# Altium schematic sheet Phaser_2.SchDoc
size A; DocumentNumber: 4; SheetNumber: 4; SheetTotal: 5
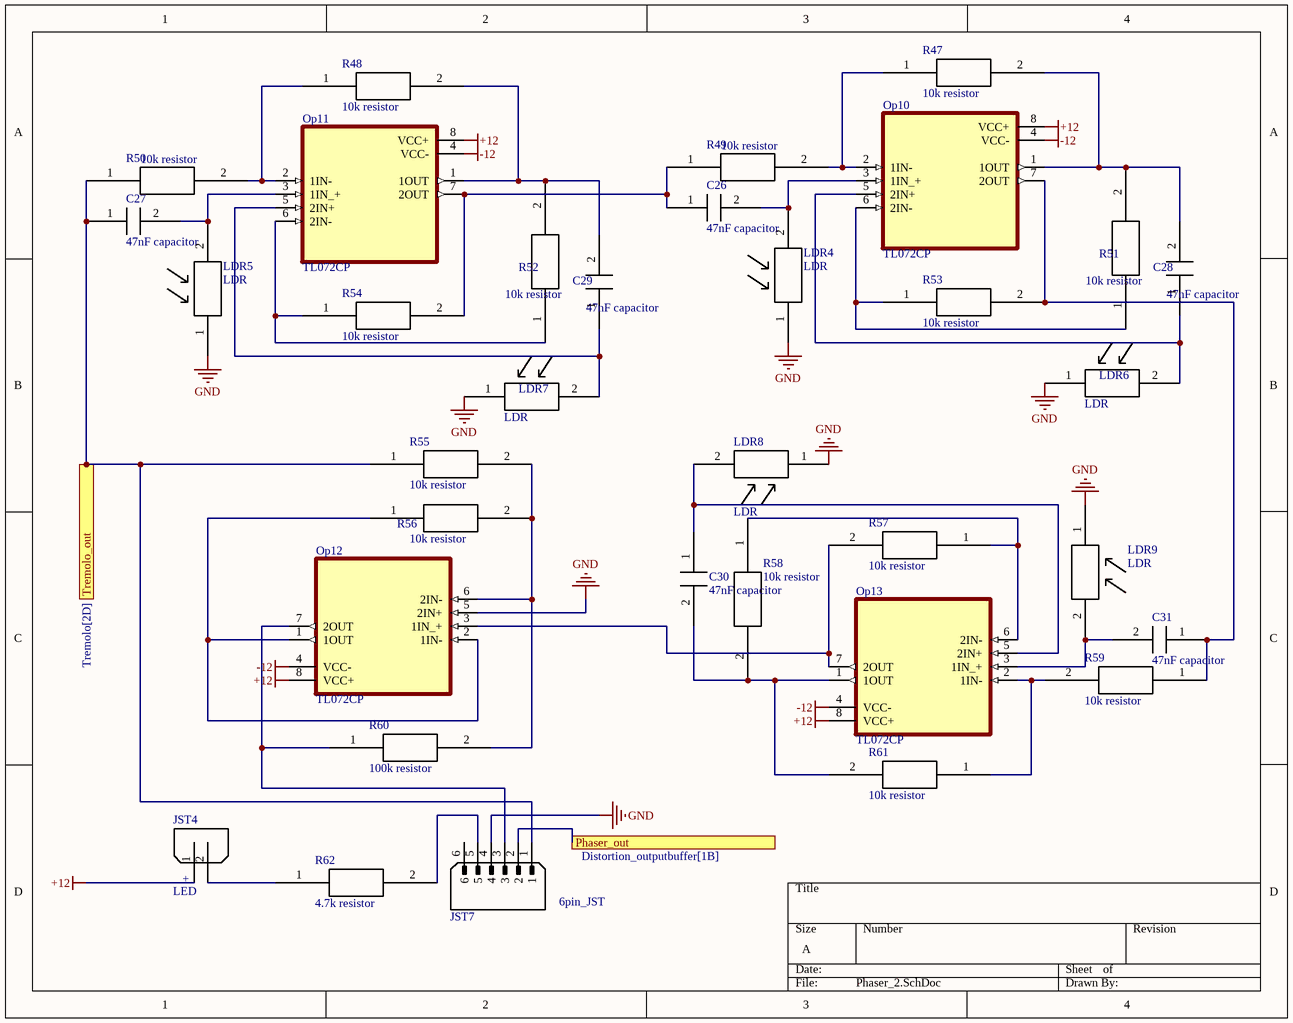
[diagram p0: Phaser_2.SchDoc]

## Parts
C26  47nF capacitor  [47nF]
C27  47nF capacitor  [47nF]
C28  47nF capacitor  [47nF]
C29  47nF capacitor  [47nF]
C30  47nF capacitor  [47nF]
C31  47nF capacitor  [47nF]
JST4  LED  [2pin_JST]
JST7  6pin_JST  [6pin_JST]
LDR4  LDR  [LDR]
LDR5  LDR  [LDR]
LDR6  LDR  [LDR]
LDR7  LDR  [LDR]
LDR8  LDR  [LDR]
LDR9  LDR  [LDR]
Op10  TL072CP  [TL072CP]
Op11  TL072CP  [TL072CP]
Op12  TL072CP  [TL072CP]
Op13  TL072CP  [TL072CP]
R47  10k resistor  [10k]
R48  10k resistor  [10k]
R49  10k resistor  [10k]
R50  10k resistor  [10k]
R51  10k resistor  [10k]
R52  10k resistor  [10k]
R53  10k resistor  [10k]
R54  10k resistor  [10k]
R55  10k resistor  [10k]
R56  10k resistor  [10k]
R57  10k resistor  [10k]
R58  10k resistor  [10k]
R59  10k resistor  [10k]
R60  100k resistor  [100k]
R61  10k resistor  [10k]
R62  4.7k resistor  [4.7k]

## Ports
Phaser_out (see Distortion_outputbuffer[1B]), Tremolo_out (see Tremolo[2D])

## Nets
+12: JST4.1 Op10.8(VCC+) Op11.8(VCC+) Op12.8(VCC+) Op13.8(VCC+)
-12: Op10.4(VCC-) Op11.4(VCC-) Op12.4(VCC-) Op13.4(VCC-)
GND: JST7.4 LDR4.1 LDR5.1 LDR6.1 LDR7.1 LDR8.1 LDR9.1 Op12.5(2IN+)
Phaser_out: JST7.2 ; port Phaser_out
Tremolo_out: C27.1 JST7.1 R50.1 R55.1 ; port Tremolo_out
NetC26_1: C26.1 Op11.7(2OUT) R49.1 R54.2
NetC26_2: C26.2 LDR4.2 Op10.3(1IN_+)
NetC27_2: C27.2 LDR5.2 Op11.3(1IN_+)
NetC28_1: C28.1 LDR6.2 Op10.5(2IN+)
NetC28_2: C28.2 Op10.1(1OUT) R47.2 R51.2
NetC29_1: C29.1 LDR7.2 Op11.5(2IN+)
NetC29_2: C29.2 Op11.1(1OUT) R48.2 R52.2
NetC30_1: C30.1 LDR8.2 Op13.5(2IN+)
NetC30_2: C30.2 Op13.1(1OUT) R58.2 R61.2
NetC31_1: C31.1 Op10.7(2OUT) R53.2 R59.1
NetC31_2: C31.2 LDR9.2 Op13.3(1IN_+)
NetJST4_2: JST4.2 R62.1
NetJST7_3: JST7.3 Op12.7(2OUT) R60.1
NetJST7_5: JST7.5 R62.2
NetOp10_2: Op10.2(1IN-) R47.1 R49.2
NetOp10_6: Op10.6(2IN-) R51.1 R53.1
NetOp11_2: Op11.2(1IN-) R48.1 R50.2
NetOp11_6: Op11.6(2IN-) R52.1 R54.1
NetOp12_1: Op12.1(1OUT) Op12.2(1IN-) R56.1
NetOp12_3: Op12.3(1IN_+) Op13.7(2OUT) R57.2
NetOp12_6: Op12.6(2IN-) R55.2 R56.2 R60.2
NetOp13_2: Op13.2(1IN-) R59.2 R61.1
NetOp13_6: Op13.6(2IN-) R57.1 R58.1

Not connected (* = marked no-connect by the designer): JST7 6

## Notes on the sheet
- (in symbol 2pin_JST) +

## Library data of the parts
JST4 = 2pin_JST